# EAGLE design 10w_LED_driver_auto (EAGLE 6.2)
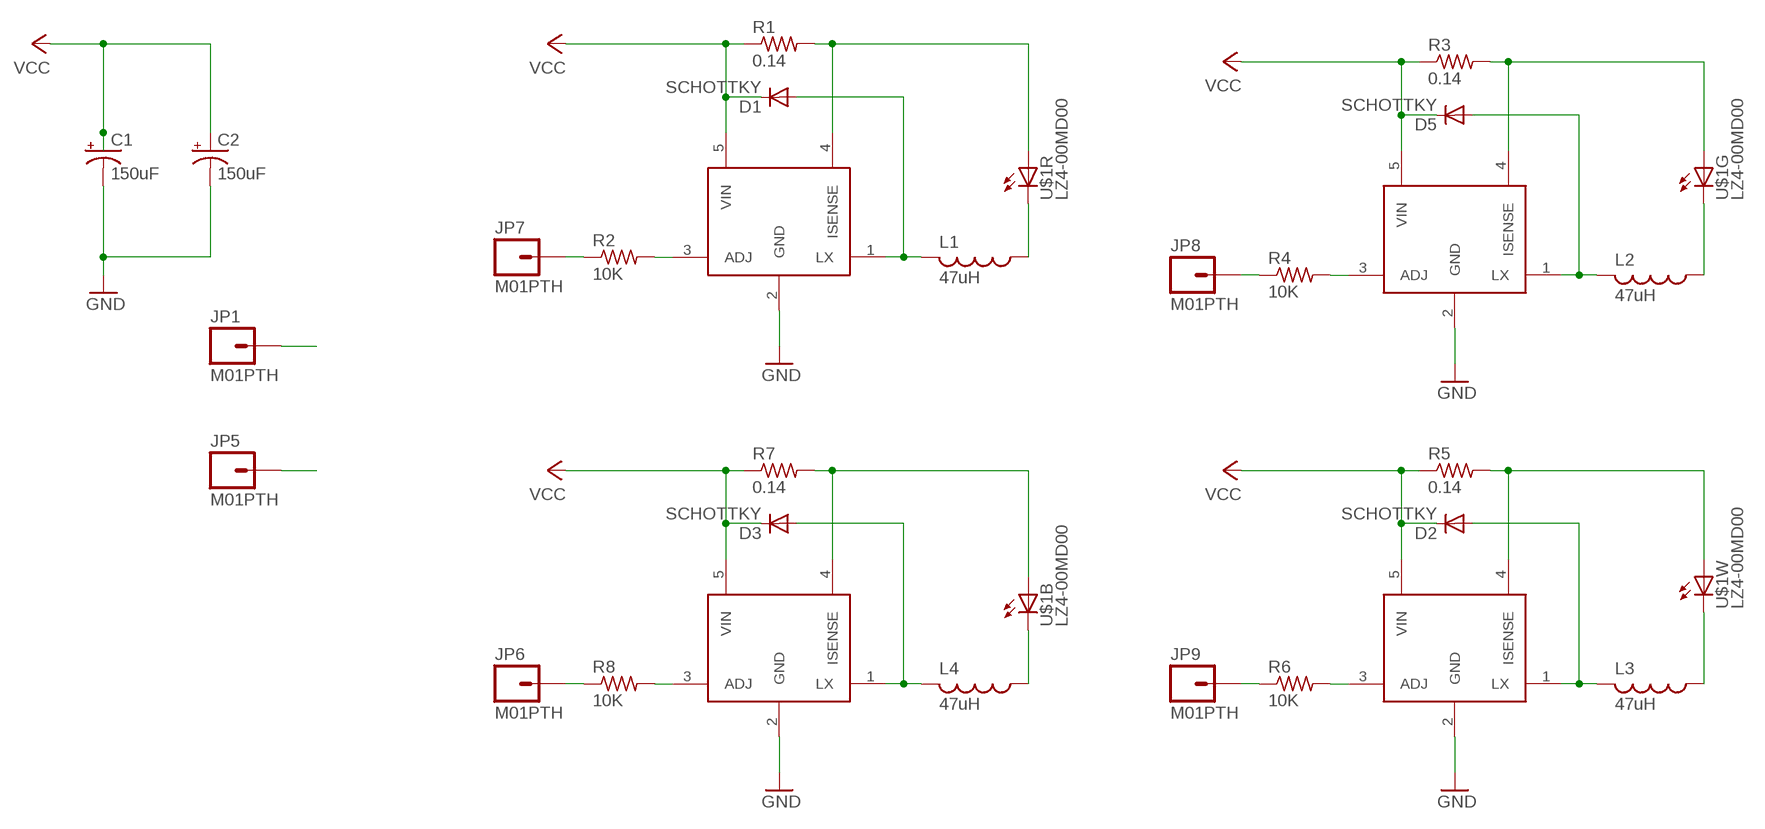
[diagram p0: schematic, sheet 1]

## Parts
C1  150uF  CPOL-US175TMP-0810  [175TMP-0810]
C2  150uF  CPOL-US175TMP-0810  [175TMP-0810]
D1  SCHOTTKY  DIODE-DO214AC  [DO214AC]
D2  SCHOTTKY  DIODE-DO214AC  [DO214AC]
D3  SCHOTTKY  DIODE-DO214AC  [DO214AC]
D5  SCHOTTKY  DIODE-DO214AC  [DO214AC]
JP1  M01PTH  [1X01]
JP5  M01PTH  [1X01]
JP6  M01PTH  [1X01]
JP7  M01PTH  [1X01]
JP8  M01PTH  [1X01]
JP9  M01PTH  [1X01]
L1  47uH  L-US  [TDK6045]
L2  47uH  L-US  [TDK6045]
L3  47uH  L-US  [TDK6045]
L4  47uH  L-US  [TDK6045]
R1  0.14  R-US_R0805  [R0805]
R2  10K  R-US_R0603  [R0603]
R3  0.14  R-US_R0805  [R0805]
R4  10K  R-US_R0603  [R0603]
R5  0.14  R-US_R0805  [R0805]
R6  10K  R-US_R0603  [R0603]
R7  0.14  R-US_R0805  [R0805]
R8  10K  R-US_R0603  [R0603]
U$1  LZ4-00MD00  [LZ4-00MD0]
U$2  ZLED7000-LEDDRIVER  [SOT89-5]
U$3  ZLED7000-LEDDRIVER  [SOT89-5]
U$4  ZLED7000-LEDDRIVER  [SOT89-5]
U$6  ZLED7000-LEDDRIVER  [SOT89-5]

## Nets
BLUE: JP6.1 R8.1
GND: C1.- C2.- JP5.1 U$2.2(GND) U$3.2(GND) U$4.2(GND) U$6.2(GND)
GREEN: JP8.1 R4.1
N$1: R2.2 U$2.3(ADJ)
N$3: R1.2 U$1.3(R:A) U$2.4(ISENSE)
N$4: L1.1 U$1.4(R:C)
N$5: D1.A L1.2 U$2.1(LX)
N$6: R3.2 U$1.5(G:A) U$6.4(ISENSE)
N$7: D5.A L2.2 U$6.1(LX)
N$8: R4.2 U$6.3(ADJ)
N$10: R5.2 U$1.1(W:A) U$3.4(ISENSE)
N$11: D2.A L3.2 U$3.1(LX)
N$12: R6.2 U$3.3(ADJ)
N$14: R7.2 U$1.7(B:A) U$4.4(ISENSE)
N$15: D3.A L4.2 U$4.1(LX)
N$16: R8.2 U$4.3(ADJ)
N$18: L4.1 U$1.8(B:C)
N$19: L2.1 U$1.6(G:C)
N$20: L3.1 U$1.2(W:C)
RED: JP7.1 R2.1
VCC: C1.+ C2.+ D1.C D2.C D3.C D5.C JP1.1 R1.1 R3.1 R5.1 R7.1 U$2.5(VIN) U$3.5(VIN) U$4.5(VIN) U$6.5(VIN)
WHITE: JP9.1 R6.1

## Library data of the parts
C1 C2 = adafruit:CPOL-US: POLARIZED CAPACITOR, American symbol
D1-D3 D5 = diode:DIODE-: DIODE
JP1 JP5-JP9 = SparkFun-Connectors:M01: Header 1 Standard 1-pin 0.1" header. Use with straight break away headers (SKU : PRT-00116), right angle break away headers (PRT-00553), swiss pins (PRT-00743), machine pins (PRT-00117), and female headers (PRT-00115).
L1-L4 = rcl:L-US: INDUCTOR, American symbol
R1-R8 = adafruit:R-US_: RESISTOR, American symbol
U$1 = led:LZ4-00MD00
U$2-U$4 U$6 = adafruit:ZLED7000-LEDDRIVER

## Net classes
0 default: width 0.508 mm

## Board
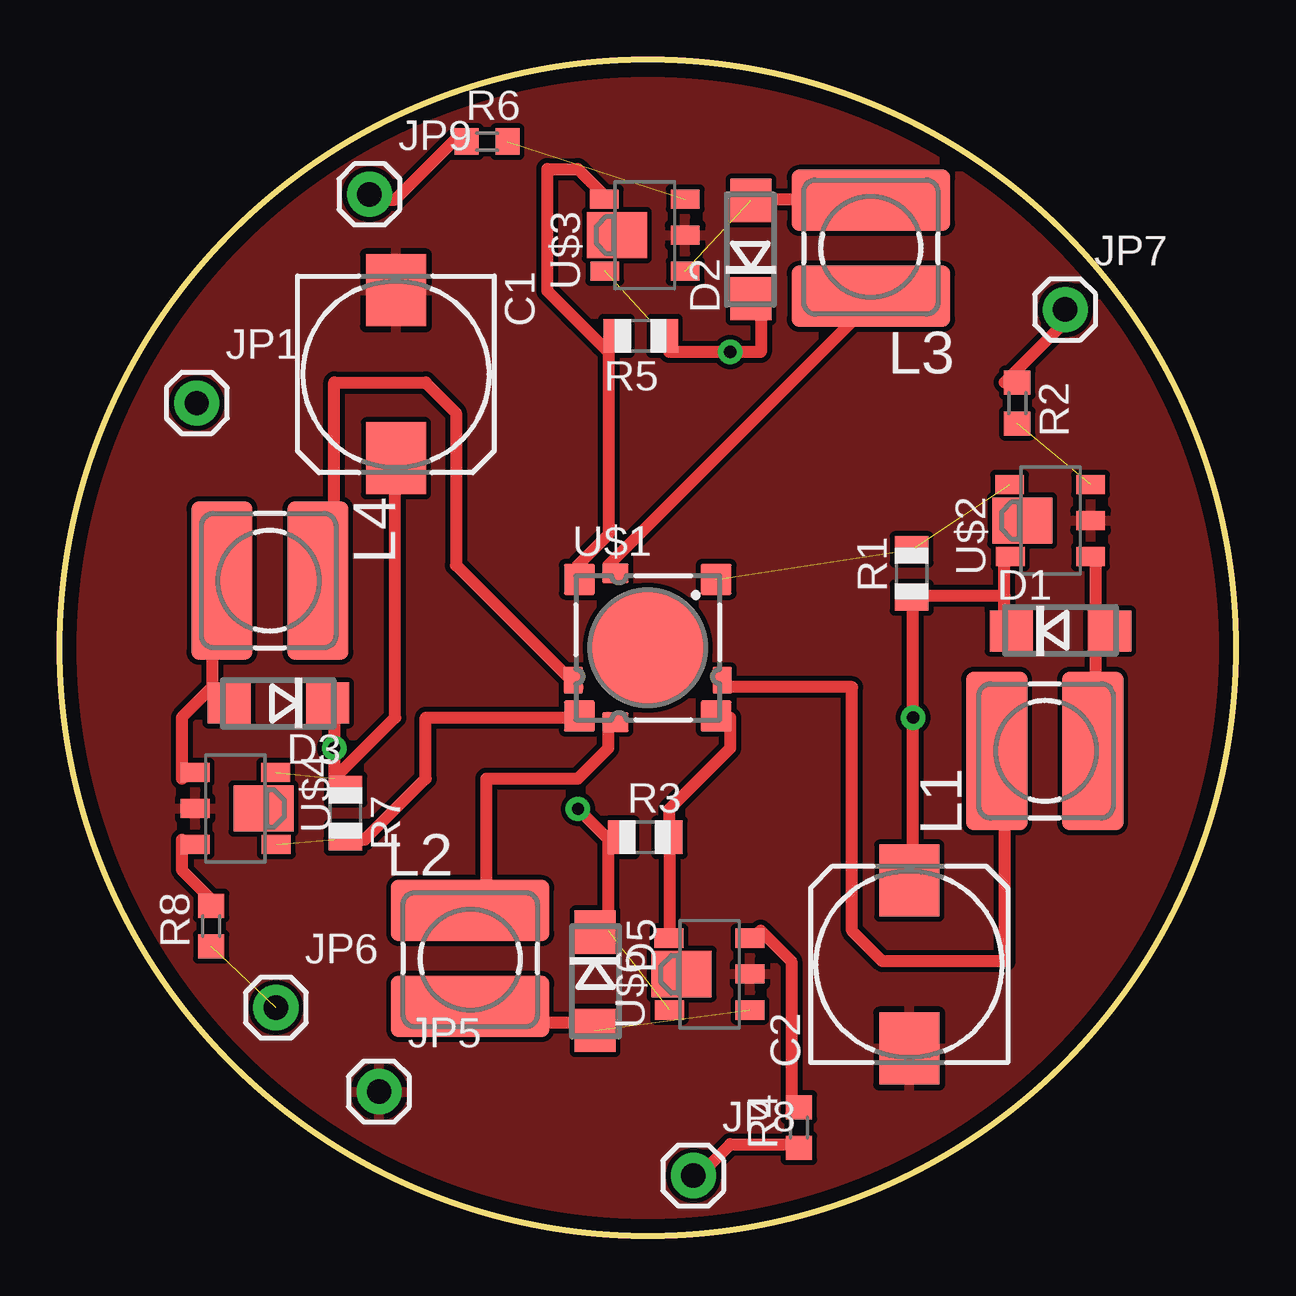
[diagram p1: board, top side]
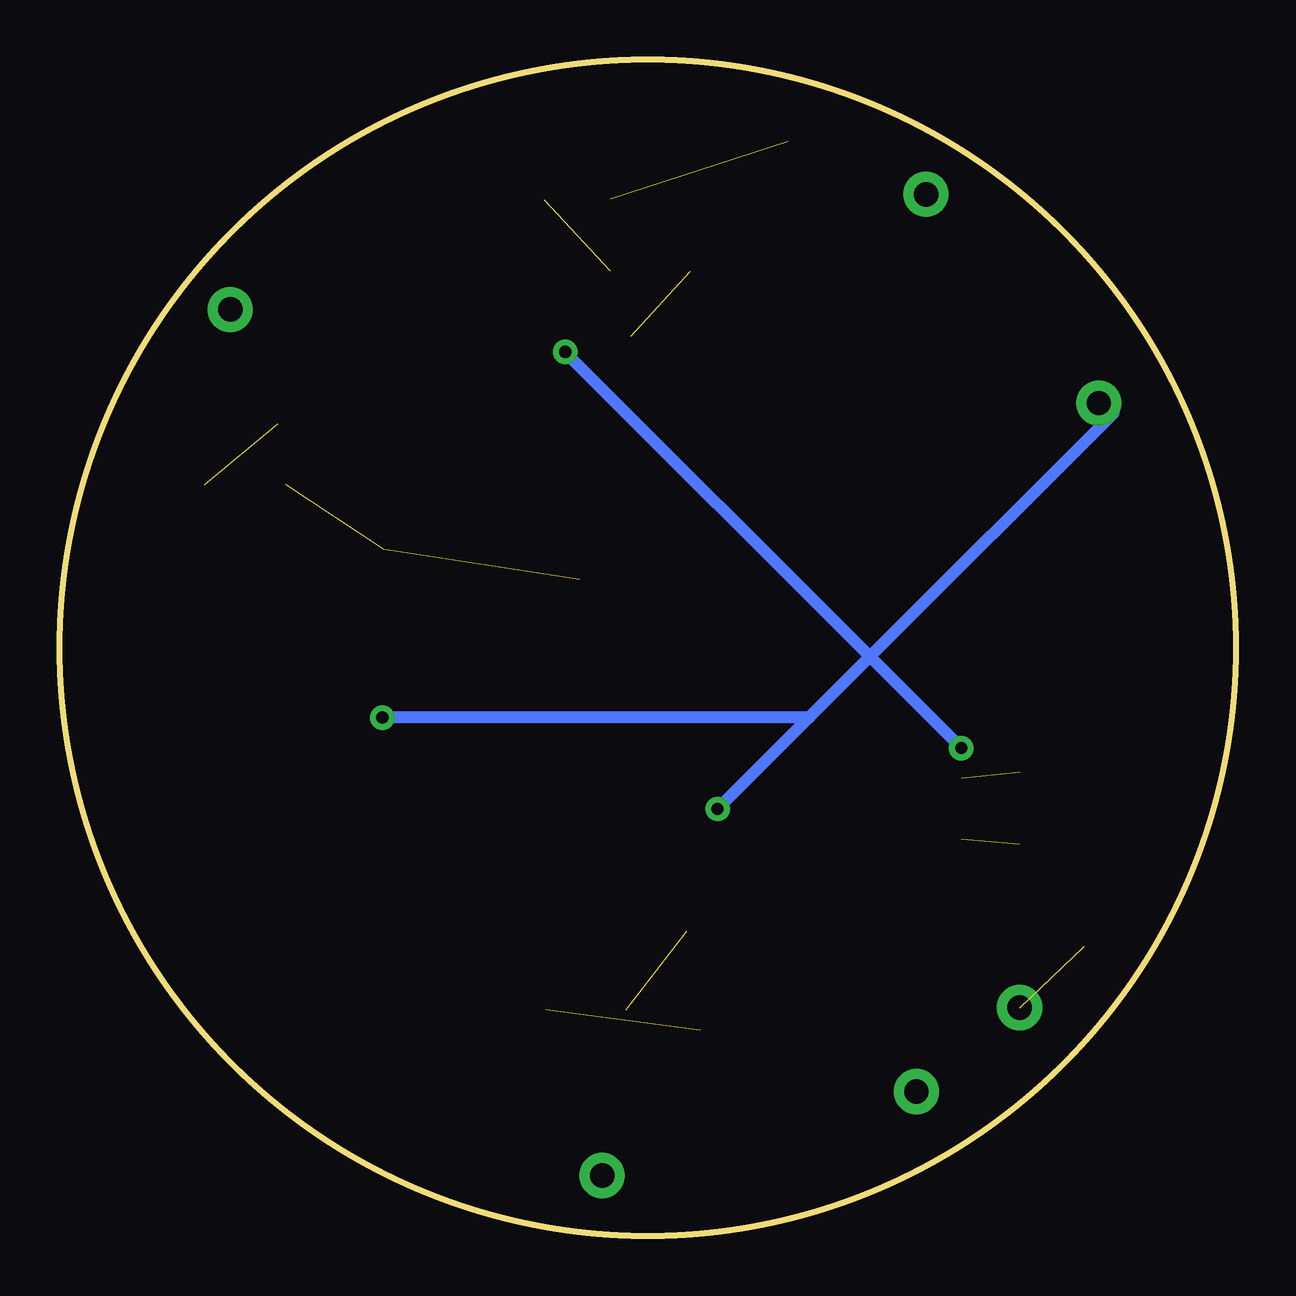
[diagram p2: board, bottom side, seen from below]

Size 49 x 49 mm. Coordinates in mm from the lower left corner, seen from the top.
Outline: circle at 24.5,24.5 radius 24.5
Copper layers (1*16): Top 0.035mm / dielectric 1.5mm / Bottom 0.035mm
Design rules: minimum track width 8mil, minimum drill 20mil, track to track 8mil, track to pad 8mil, pad to pad 8mil, via to via 8mil, smd to smd 8mil, copper to edge 22mil, drill to drill 8mil, minimum pad ring 12mil, minimum via ring 10mil, stop-mask expansion 4mil, vias tented up to drill 25mil, thermal gap 10mil

### Footprints (pad centres in the part's own frame; a part is rotated, then mirrored left to right if it is on the bottom)
175TMP-0810 = smd 3 x 2.5: + 3.5,0; - -3.5,0
DO214AC = smd 1.8 x 1.7: A 2.05,0; C -2.05,0
1X01 = drill 1.016 pad 1.88: 1 0,0
TDK6045 = smd 6.6 x 2.55: 1 0,2.05; 2 0,-1.95
R0805 = smd 1.1 x 1.4: 1 -1,0; 2 1,0
R0603 = smd 1 x 1.1: 1 -0.85,0; 2 0.85,0
LZ4-00MD0 = smd 1.3 x 1.3: 1 -2.85,2.85; 3 2.85,2.85; 5 2.85,-2.85; 7 -2.85,-2.85 | smd 1.1 x 0.8: 2 -1.35,3.1; 6 -1.35,-3.1 | smd 0.8 x 1.1: 4 3.1,-1.35; 8 -3.1,-1.35 | smd 5 x 5: 9 0,0
SOT89-5 = smd 0.8 x 1.2: 1 -1.5,-2.362; 2 0.001,-2.362; 3 1.5,-2.362; 4 1.5,1.016; 5 -1.5,0.991 | smd 1.93 x 2.5: THEM 0,0.488

### Placement (x,y rotation side)
C1  14,35.9 270 top
C2  35.4,11.3 90 top
D1  41.7,25.2 0 top
D2  28.8,41.1 90 top
D3  9.1,22.2 180 top
D5  22.3,10.6 270 top
JP1  5.7,34.7 0 top
JP5  13.3,6 0 top
JP6  9,9.5 0 top
JP7  41.9,38.6 0 top
JP8  26.4,2.5 0 top
JP9  12.9,43.4 0 top
L1  41.1,20.2 90 top
L2  17.1,11.5 0 top
L3  33.8,41.2 180 top
L4  8.7,27.3 270 top
R1  35.5,27.6 90 top
R2  39.9,34.7 270 top
R3  24.4,16.6 0 top
R4  30.8,4.5 90 top
R5  24.2,37.5 180 top
R6  17.8,45.6 0 top
R7  11.9,17.6 270 top
R8  6.3,12.9 90 top
U$1  24.5,24.5 0 top
U$2  40.6,29.8 90 top
U$3  23.7,41.7 90 top
U$4  8,17.8 270 top
U$6  26.4,10.9 90 top

### Tracks (layer width: path | path; a pad name or v marks a point on that pad's centre or on a via)
BLUE  (1 unrouted)
GND
  pour Top: 42.5,41.2 arc-90 42.5,7.7 arc-90 6.5,7.7 arc-90 6.5,41.2 arc-90
GREEN
  Top 0.508: R4.1 30.48,3.81 27.94,3.81 26.67,2.54 JP8.1
N$1  (1 unrouted)
N$3  (2 unrouted)
N$4
  Top 0.508: U$1.4 27.94,22.86 33.02,22.86 33.02,12.7 34.29,11.43 39.37,11.43 39.37,19.05 L1.1
N$5
  Top 0.508: 43.18,25.4 43.18,27.94 U$2.1 | 43.18,25.4 43.18,20.32 L1.2 | 43.18,25.4 D1.A
N$6
  Top 0.508: U$6.4 25.4,12.7 25.4,16.51 R3.2 25.4,17.78 27.94,20.32 27.94,21.59 U$1.5
N$7  (1 unrouted)
  Top 0.508: D5.A 21.59,8.89 17.78,8.89 L2.2
N$8
  Top 0.508: R4.2 30.48,5.08 30.48,11.43 29.21,12.7 U$6.3
N$10
  Top 0.508: 22.86,36.83 20.32,39.37 20.32,44.45 21.59,44.45 22.86,43.18 U$3.4 | 22.86,36.83 22.86,29.21 21.59,27.94 U$1.1 | 22.86,36.83 R5.2
N$11  (1 unrouted)
  Top 0.508: D2.A 29.21,43.18 33.02,43.18 L3.2
N$12  (1 unrouted)
N$14  (1 unrouted)
  Top 0.508: U$1.7 21.59,21.59 15.24,21.59 15.24,19.05 12.7,16.51 11.43,16.51 R7.2
N$15
  Top 0.508: 6.35,22.86 5.08,21.59 5.08,19.05 U$4.1 | 6.35,22.86 6.35,26.67 L4.2 | 6.35,22.86 D3.A
N$16
  Top 0.508: R8.2 6.35,13.97 5.08,15.24 5.08,16.51 U$4.3
N$18
  Top 0.508: U$1.8 21.59,22.86 16.51,27.94 16.51,34.29 15.24,35.56 11.43,35.56 11.43,27.94 L4.1
N$19
  Top 0.508: U$1.6 22.86,21.59 22.86,20.32 21.59,19.05 17.78,19.05 17.78,13.97 L2.1
N$20
  Top 0.508: U$1.2 22.86,27.94 33.02,38.1 L3.1
RED
  Top 0.508: R2.1 39.37,35.56 41.91,38.1 JP7.1
VCC  (via drill 0.51)  (3 unrouted)
  Top 0.508: 39.37,26.67 39.37,25.4 D1.C | 39.37,26.67 39.37,27.94 U$2.5 | 35.56,26.67 v35.56,21.59 35.56,15.24 C2.+ | 35.56,26.67 39.37,26.67 | 35.56,26.67 R1.1 | 11.43,19.05 v11.43,20.32 11.43,21.59 D3.C | 11.43,19.05 13.97,21.59 13.97,31.75 C1.+ | 11.43,19.05 R7.1 | R5.1 25.4,36.83 v27.94,36.83 29.21,36.83 29.21,39.37 D2.C | 22.86,16.51 22.86,12.7 D5.C | v21.59,17.78 22.86,16.51 | 22.86,16.51 R3.1
  Bottom 0.508: 15.24,24.13 5.08,34.29 JP1.1 | 15.24,24.13 17.78,21.59 | 17.78,21.59 v21.59,17.78 | 15.24,24.13 v27.94,36.83 | 15.24,24.13 v11.43,20.32 | 17.78,21.59 v35.56,21.59
WHITE
  Top 0.508: R6.1 16.51,45.72 13.97,43.18 12.7,43.18 JP9.1